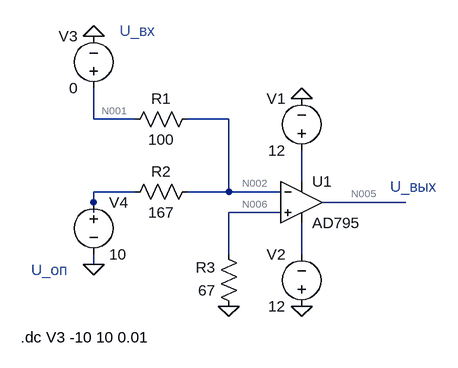
[diagram p0: schematic task2.asc]
task2.asc, the LTspice schematic file:
Version 4.1
SHEET 1 880 680
WIRE -160 32 -160 -16
WIRE -96 32 -160 32
WIRE 48 32 -16 32
WIRE 160 128 160 80
WIRE -96 144 -160 144
WIRE 48 144 48 32
WIRE 48 144 -16 144
WIRE 128 144 48 144
WIRE -160 160 -160 144
WIRE 320 160 192 160
WIRE -160 176 -160 160
WIRE 128 176 48 176
WIRE 48 240 48 176
WIRE 160 240 160 192
WIRE -160 256 -160 240
FLAG 160 0 0
FLAG 160 320 0
FLAG -160 256 0
FLAG -160 -96 0
FLAG 48 320 0
SYMBOL OpAmps\\AD795 160 96 R0
SYMATTR InstName U1
SYMBOL voltage 160 96 R180
WINDOW 0 24 96 Left 2
WINDOW 3 24 16 Left 2
SYMATTR InstName V1
SYMATTR Value 12
SYMBOL voltage 160 336 R180
WINDOW 0 24 96 Left 2
WINDOW 3 24 16 Left 2
SYMATTR InstName V2
SYMATTR Value 12
SYMBOL res 0 16 R90
WINDOW 0 0 56 VBottom 2
WINDOW 3 32 56 VTop 2
SYMATTR InstName R1
SYMATTR Value 100
SYMBOL res 0 128 R90
WINDOW 0 0 56 VBottom 2
WINDOW 3 32 56 VTop 2
SYMATTR InstName R2
SYMATTR Value 167
SYMBOL res 64 336 R180
WINDOW 0 36 76 Left 2
WINDOW 3 36 40 Left 2
SYMATTR InstName R3
SYMATTR Value 67
SYMBOL voltage -160 0 R180
WINDOW 0 24 96 Left 2
WINDOW 3 24 16 Left 2
WINDOW 123 0 0 Left 0
WINDOW 39 0 0 Left 0
SYMATTR InstName V3
SYMATTR Value 0
SYMBOL voltage -160 144 R0
SYMATTR InstName V4
SYMATTR Value 10
TEXT -120 -104 Left 2 ;U_вх
TEXT -256 264 Left 2 ;U_оп
TEXT 296 136 Left 2 ;U_вых
TEXT -272 368 Left 2 !.dc V3 -10 10 0.01

The netlist it stands for:
* task2.asc
X§U1 N006 N002 N003 N007 N005 AD795  ; pins In+ In- V+ V- OUT
V1 N003 0 12
V2 0 N007 12
R1 N002 N001 100
R2 N002 N004 167
R3 0 N006 67
V3 N001 0 0
V4 N004 0 10
* U_вх
* U_оп
* U_вых
.dc V3 -10 10 0.01
.lib ADI1.lib
.backanno
.end

* Results of the author's LTspice run, read from the files saved beside the schematic
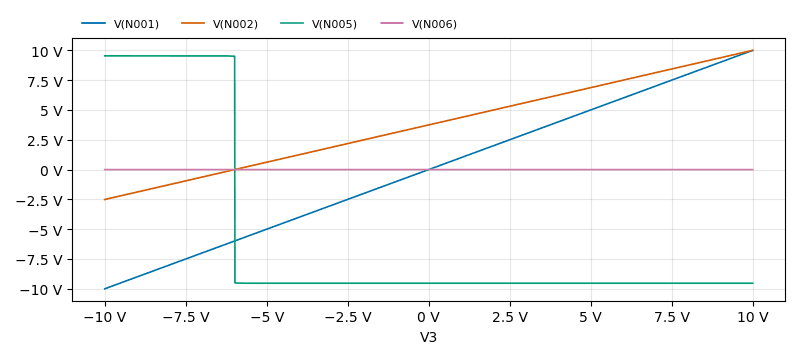
[diagram p1: DC transfer characteristic of task2.asc, plotted from the saved traces]
* DC transfer characteristic, 1 run:
*   V(N001): -10 V at V3=-10 V, 10 V at V3=10 V, min -10 V, max 10 V
*   V(N002): -2.509 V at V3=-10 V, 10 V at V3=10 V, min -2.509 V, max 10 V
*   V(N005): 9.54 V at V3=-10 V, -9.532 V at V3=10 V, min -9.532 V, max 9.54 V
*   V(N006): -166.5 pV at V3=-10 V, 663.4 pV at V3=10 V, min -166.5 pV, max 663.4 pV